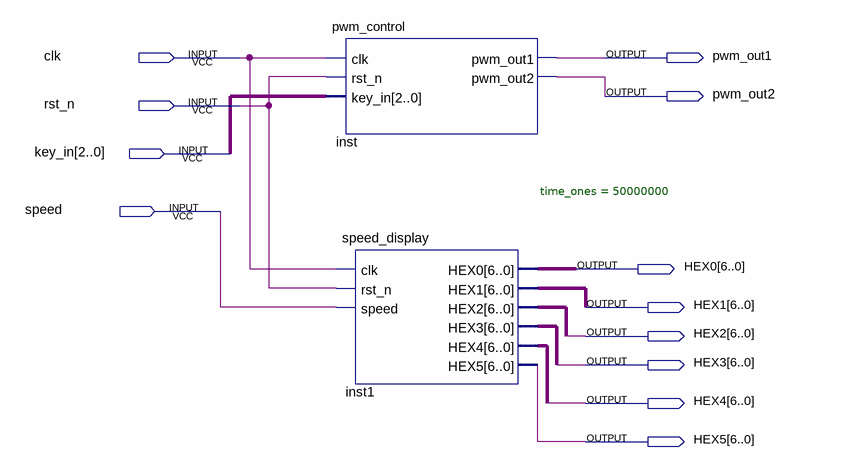
[diagram p0: schematic sheet]
// Quartus schematic top.bdf as structural Verilog: 2 symbols, 12 pins
module top (
  input  clk,
  input  rst_n,
  input  [2:0] key_in,
  input  speed,
  output pwm_out1,
  output pwm_out2,
  output [6:0] HEX0,
  output [6:0] HEX1,
  output [6:0] HEX2,
  output [6:0] HEX3,
  output [6:0] HEX4,
  output [6:0] HEX5
);

  wire [6:0] inst1_hex2, inst1_hex3, inst1_hex4;

  pwm_control inst (.clk(clk), .rst_n(rst_n), .key_in(key_in), .pwm_out1(pwm_out1), .pwm_out2(pwm_out2));
  speed_display #(.time_ones(50000000)) inst1 (
    .clk(clk), .rst_n(rst_n), .speed(speed), .HEX0(HEX0), .HEX1(HEX1), .HEX2(inst1_hex2), .HEX3(inst1_hex3),
    .HEX4(inst1_hex4), .HEX5(HEX5));
endmodule
